# EAGLE design coreOne (EAGLE 4.16)
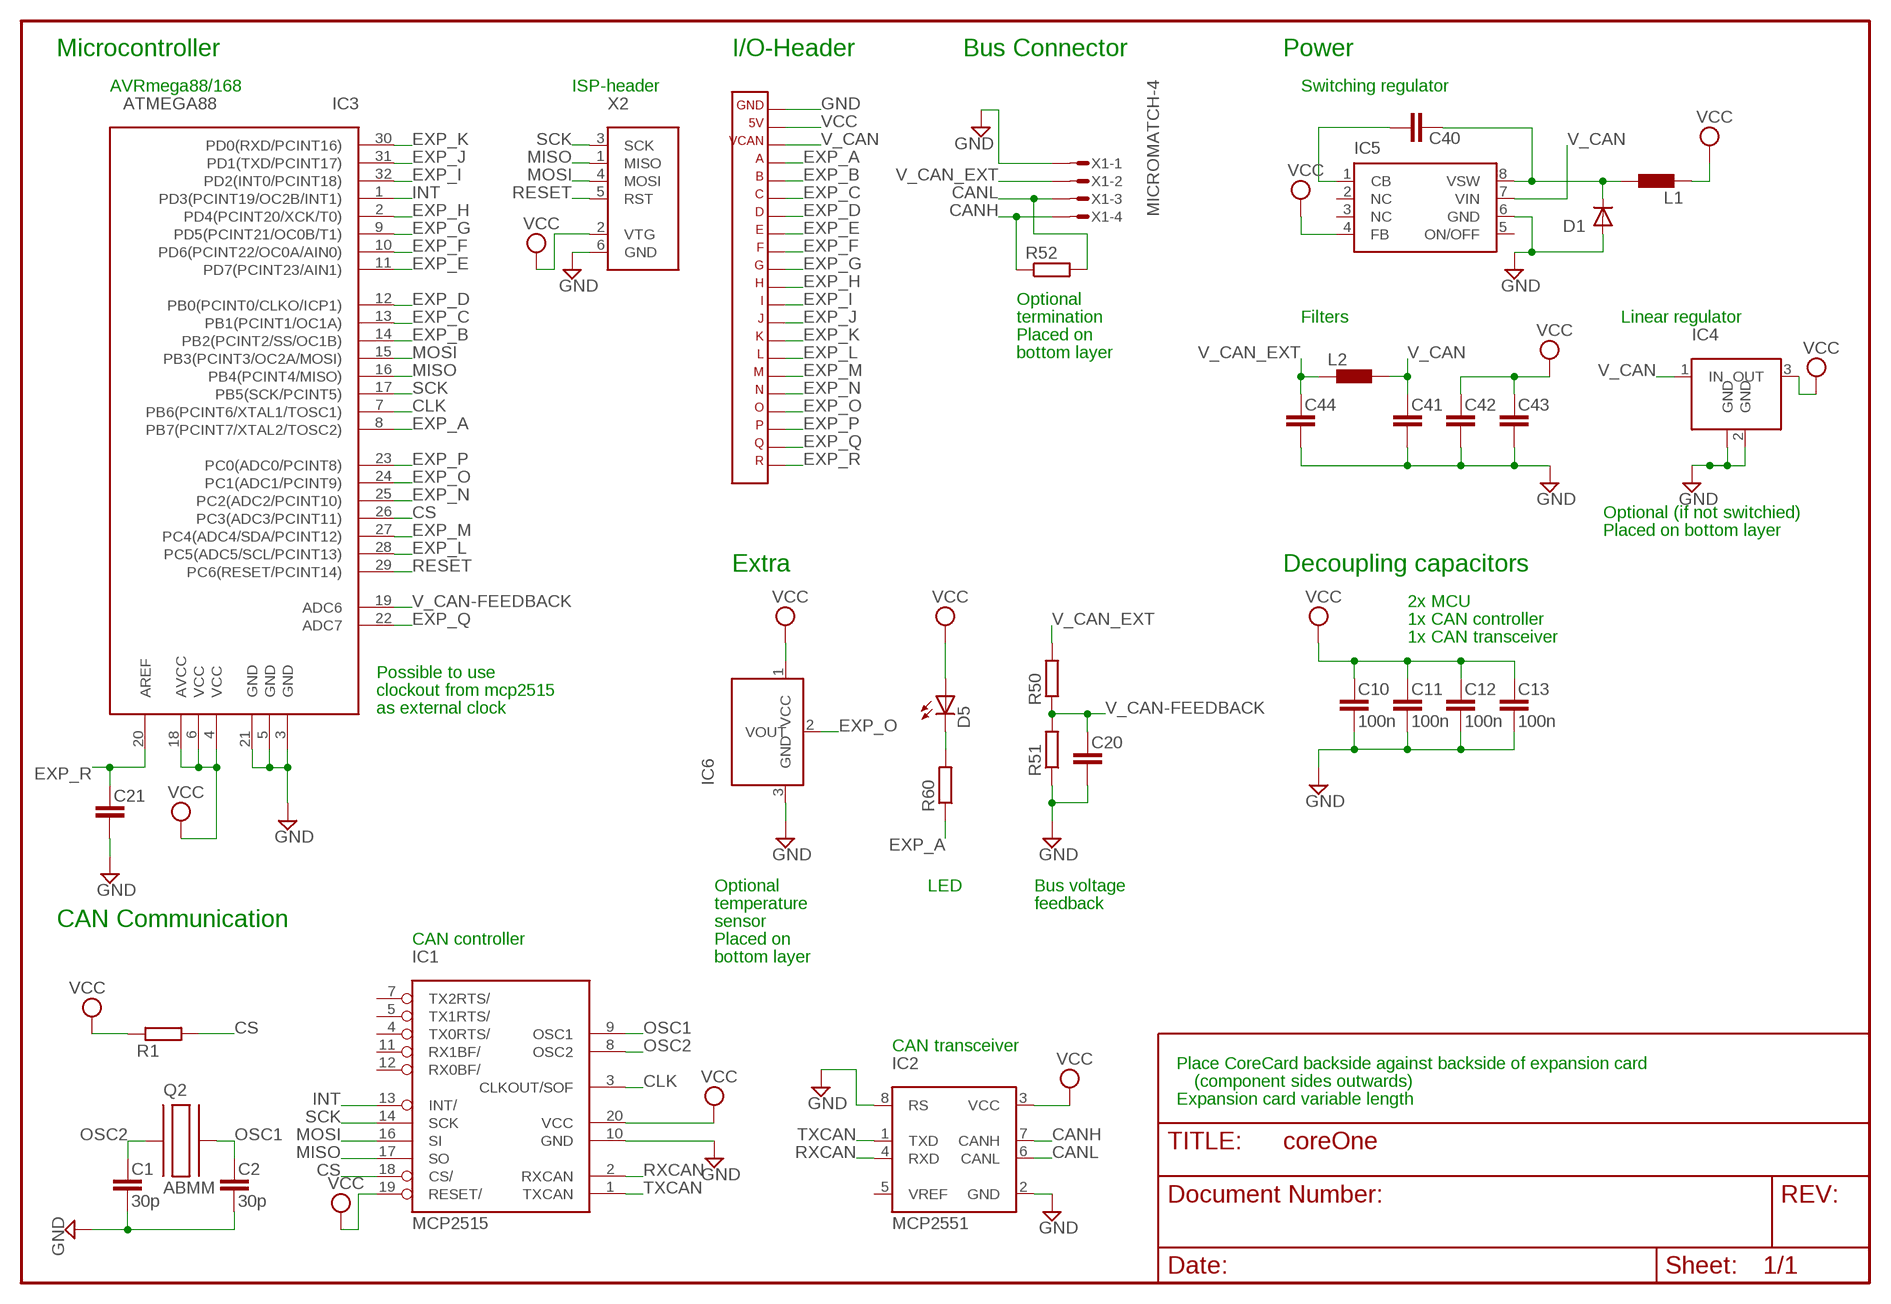
[diagram p0: schematic, sheet 1]

## Parts
C1  30p  C-EUC0603  [C0603]
C2  30p  C-EUC0603  [C0603]
C10  100n  C-EUC0603  [C0603]
C11  100n  C-EUC0603  [C0603]
C12  100n  C-EUC0603  [C0603]
C13  100n  C-EUC0603  [C0603]
C20  C-EUC0603  [C0603]
C21  C-EUC0603  [C0603]
C40  C-EUC0603  [C0603]
C41  C-EUC1210  [C1210]
C42  C-EUC1210  [C1210]
C43  C-EUC0603  [C0603]
C44  C-EUC0603  [C0603]
D1  DIODESMP  [DO-220AA]
D5  LED  [0603]
IC1  MCP2515  [TSSOP]
IC2  MCP2551  [SOIC]
IC3  ATMEGA88  [TQFP32]
IC4  LM340MP-5.0  [SOT223]
IC5  LM2674  [SO8]
IC6  TC1047A  [SOT23]
L1  L-EUL1812  [L1812]
L2  L-EUL0603  [L0603]
Q2  ABMM  [SMD]
R1  R-EUR0603  [R0603]
R50  R-EUR0603  [R0603]
R51  R-EUR0603  [R0603]
R52  R-EUR0603  [R0603]
R60  R-EUR0603  [R0603]
X1  MICROMATCH-4  [MICROMATCH-4]
X2  AVRISP6PINHEADER  [6PINHEADER]
X3  CORE_IOHEAD  [CORE_IOHEAD]

## Nets
CANH: IC2.7(CANH) R52.1 X1.4
CANL: IC2.6(CANL) R52.2 X1.3
CB: C40.1 IC5.1(CB)
CLK: IC1.3(CLKOUT/SOF) IC3.7(PB6(PCINT6/XTAL1/TOSC1))
CS: IC1.18(CS/) IC3.26(PC3(ADC3/PCINT11)) R1.2
EXP_A: IC3.8(PB7(PCINT7/XTAL2/TOSC2)) R60.1 X3.4
EXP_B: IC3.14(PB2(PCINT2/SS/OC1B)) X3.5
EXP_C: IC3.13(PB1(PCINT1/OC1A)) X3.6
EXP_D: IC3.12(PB0(PCINT0/CLKO/ICP1)) X3.7
EXP_E: IC3.11(PD7(PCINT23/AIN1)) X3.8
EXP_F: IC3.10(PD6(PCINT22/OC0A/AIN0)) X3.9
EXP_G: IC3.9(PD5(PCINT21/OC0B/T1)) X3.10
EXP_H: IC3.2(PD4(PCINT20/XCK/T0)) X3.11
EXP_I: IC3.32(PD2(INT0/PCINT18)) X3.12
EXP_J: IC3.31(PD1(TXD/PCINT17)) X3.13
EXP_K: IC3.30(PD0(RXD/PCINT16)) X3.14
EXP_L: IC3.28(PC5(ADC5/SCL/PCINT13)) X3.15
EXP_M: IC3.27(PC4(ADC4/SDA/PCINT12)) X3.16
EXP_N: IC3.25(PC2(ADC2/PCINT10)) X3.17
EXP_O: IC3.24(PC1(ADC1/PCINT9)) IC6.2(VOUT) X3.18
EXP_P: IC3.23(PC0(ADC0/PCINT8)) X3.19
EXP_Q: IC3.22(ADC7) X3.20
EXP_R: C21.1 IC3.20(AREF) X3.21
GND: C1.2 C2.2 C10.2 C11.2 C12.2 C13.2 C20.2 C21.2 C41.2 C42.2 C43.2 C44.2 D1.A IC1.10(GND) IC2.2(GND) IC2.8(RS) IC3.3(GND) IC3.5(GND) IC3.21(GND) IC4.2(GND) IC4.4(GND) IC5.6(GND) IC6.3(GND) R51.1 X1.1 X2.6(GND) X3.1
INT: IC1.13(INT/) IC3.1(PD3(PCINT19/OC2B/INT1))
MISO: IC1.17(SO) IC3.16(PB4(PCINT4/MISO)) X2.1(MISO)
MOSI: IC1.16(SI) IC3.15(PB3(PCINT3/OC2A/MOSI)) X2.4(MOSI)
N$2: D5.C R60.2
OSC1: C2.1 IC1.9(OSC1) Q2.2
OSC2: C1.1 IC1.8(OSC2) Q2.1
RESET: IC3.29(PC6(RESET/PCINT14)) X2.5(RST)
RXCAN: IC1.2(RXCAN) IC2.4(RXD)
SCK: IC1.14(SCK) IC3.17(PB5(SCK/PCINT5)) X2.3(SCK)
TXCAN: IC1.1(TXCAN) IC2.1(TXD)
V_CAN: C41.1 IC4.1(IN) IC5.7(VIN) L2.2 X3.3
V_CAN-FEEDBACK: C20.1 IC3.19(ADC6) R50.1 R51.2
V_CAN_EXT: C44.1 L2.1 R50.2 X1.2
VCC: C10.1 C11.1 C12.1 C13.1 C42.1 C43.1 D5.A IC1.19(RESET/) IC1.20(VCC) IC2.3(VCC) IC3.4(VCC) IC3.6(VCC) IC3.18(AVCC) IC4.3(OUT) IC5.4(FB) IC6.1(VCC) L1.1 R1.1 X2.2(VTG) X3.2
VSW: C40.2 D1.C IC5.8(VSW) L1.2
Unconnected: IC1.4(TX0RTS/) IC1.5(TX1RTS/) IC1.7(TX2RTS/) IC1.11(RX1BF/) IC1.12(RX0BF/) IC2.5(VREF) IC5.2(NC) IC5.3(NC) IC5.5(ON/OFF)

## Notes on the sheet
- Microcontroller | I/O-Header | Bus Connector | Power
- AVRmega88/168 | ISP-header | Switching regulator
- Optional
- termination | Filters | Linear regulator
- Placed on
- bottom layer
- Optional (if not switchied)
- Placed on bottom layer
- Extra | Decoupling capacitors
- 2x MCU
- 1x CAN controller
- 1x CAN transceiver
- Possible to use
- clockout from mcp2515
- as external clock
- Optional | LED | Bus voltage
- temperature | feedback
- CAN Communication | sensor
- CAN controller | Placed on
- bottom layer
- CAN transceiver
- Place CoreCard backside against backside of expansion card
- (component sides outwards)
- Expansion card variable length

## Power pins joined to a net without a drawn wire
GND: Q2.GND@0(GND) Q2.GND@1(GND)

## Library data of the parts
C1 C2 C10-C13 C20 C21 C40-C44 = rcl:C-EU
D1 = diode:DIODE: DIODE ultra fast rectifier, 3 A
D5 = led:LED
IC1 = mcp2515:MCP2515
IC2 = mcp2551:MCP2551
IC3 = atmega88:ATMEGA88
IC4 = lm340mp:LM340MP-5.0
IC5 = lm2674:LM2674
IC6 = tc1047a:TC1047A
L1 L2 = rcl:L-EU
Q2 = abmm:ABMM
R1 R50-R52 R60 = rcl:R-EU
X1 = con-amp-micromatch:MICROMATCH-4: MicroMaTch 4 7-215464-4 / 0-215464-4 Drawing Number C-215464 DDEController.pdf
X2 = avrisp:AVRISP6PIN
X3 = expboard:CORE_IOHEAD: CoreCard IO-header for expansion cards

## Board
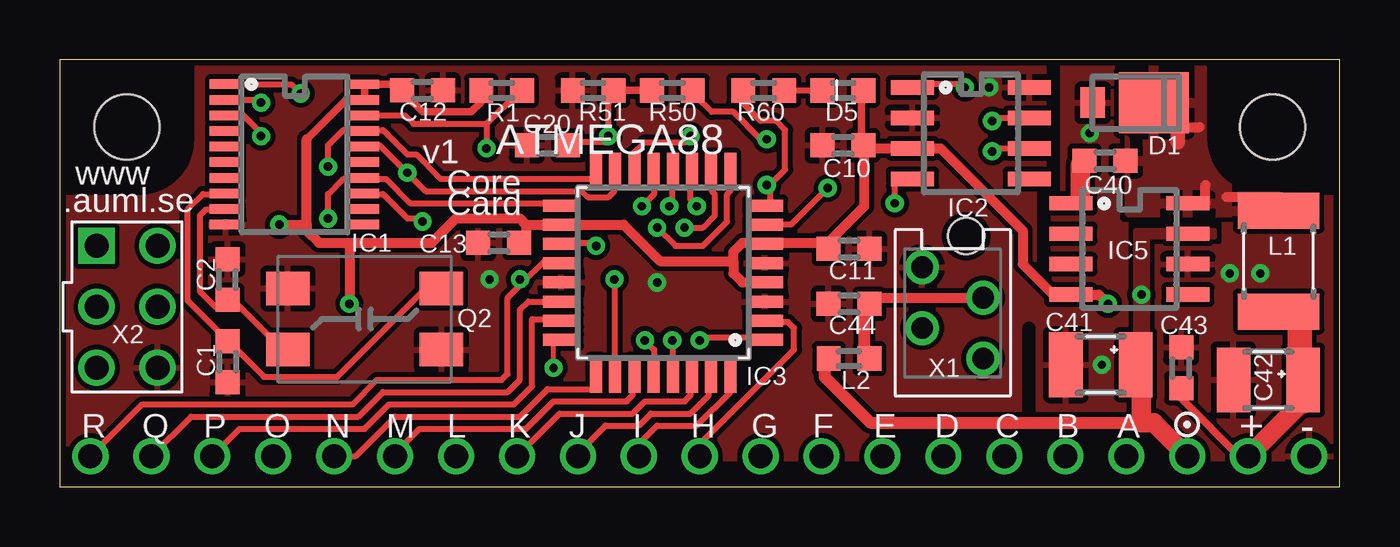
[diagram p1: board, top side]
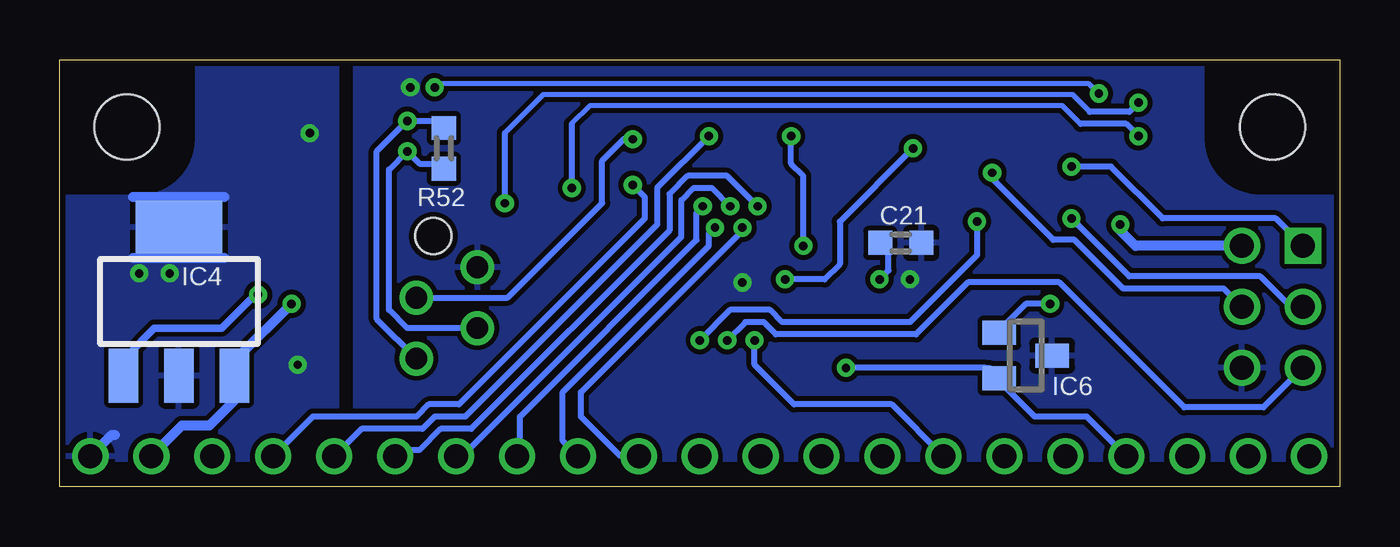
[diagram p2: board, bottom side, seen from below]

Size 53.34 x 17.78 mm. Coordinates in mm from the lower left corner, seen from the top.
Outline: 0,0 53.34,0 53.34,17.78 0,17.78 0,0
Copper layers (1*16): Top 0.035mm / dielectric 1.5mm / Bottom 0.035mm
Design rules "10mils, 0.6drill": minimum track width 8mil, minimum drill 0.35mm, track to track 8mil, track to pad 8mil, pad to pad 8mil, via to via 8mil, smd to smd 8mil, copper to edge 10mil, drill to drill 10mil, minimum pad ring 10mil, minimum via ring 8mil, stop-mask expansion 0mil, vias tented up to drill 16mil, thermal gap 10mil
Holes 2.7 mm at 50.55,14.99 2.79,14.99
tRestrict: 4 lines
bRestrict: 1 lines

### Footprints (pad centres in the part's own frame; a part is rotated, then mirrored left to right if it is on the bottom)
C0603 = smd 1 x 1: 1 -0.85,0; 2 0.85,0
C1210 = smd 1.4 x 2.7: 1 -1.4,0; 2 1.5,0
DO-220AA = smd 1.016 x 1.27: A 1.143,0 | smd 2.921 x 2.54: C -1.397,0
0603 = smd 0.991 x 1.016: A -0.85,0; C 0.85,0
TSSOP = smd 0.396 x 1.3: 1 -2.925,-2.875; 2 -2.275,-2.875; 3 -1.625,-2.875; 4 -0.975,-2.875; 5 -0.325,-2.875; 6 0.325,-2.875; 7 0.975,-2.875; 8 1.625,-2.875; 9 2.275,-2.875; 10 2.925,-2.875; 11 2.925,2.875; 12 2.275,2.875; 13 1.625,2.875; 14 0.975,2.875; 15 0.325,2.875; 16 -0.325,2.875; 17 -0.975,2.875; 18 -1.625,2.875; 19 -2.275,2.875 | smd 0.369 x 1.3: 20 -2.925,2.875
SOIC = smd 0.6 x 1.8: 1 -1.905,-2.44; 2 -0.635,-2.44; 3 0.635,-2.44; 4 1.905,-2.44; 5 1.905,2.44; 6 0.635,2.44; 7 -0.635,2.44; 8 -1.905,2.44
TQFP32 = smd 1.5 x 0.5: 1 -4.25,2.65; 2 -4.25,1.85; 3 -4.25,1.05; 4 -4.25,0.25; 5 -4.25,-0.55; 6 -4.25,-1.35; 7 -4.25,-2.15; 8 -4.25,-2.95; 17 4.25,-2.95; 18 4.25,-2.15; 19 4.25,-1.35; 20 4.25,-0.55; 21 4.25,0.25; 22 4.25,1.05; 23 4.25,1.85; 24 4.25,2.65 | smd 0.5 x 1.5: 9 -2.8,-4.4; 10 -2,-4.4; 11 -1.2,-4.4; 12 -0.4,-4.4; 13 0.4,-4.4; 14 1.2,-4.4; 15 2,-4.4; 16 2.8,-4.4; 25 2.8,4.1; 26 2,4.1; 27 1.2,4.1; 28 0.4,4.1; 29 -0.4,4.1; 30 -1.2,4.1; 31 -2,4.1; 32 -2.8,4.1
SOT223 = smd 1.219 x 2.235: 1 -2.311,-3.099; 2 0,-3.099; 3 2.311,-3.099 | smd 3.6 x 2.2: 4 0,3.099
SO8 = smd 0.6 x 1.8: 1 -1.905,-2.44; 2 -0.635,-2.44; 3 0.635,-2.44; 4 1.905,-2.44; 5 1.905,2.44; 6 0.635,2.44; 7 -0.635,2.44; 8 -1.905,2.44
SOT23 = smd 1 x 1.4: 1 -0.95,-1.1; 2 0.95,-1.1; 3 0,1.1
L1812 = smd 1.5 x 3.4: 1 -2.1,0; 2 2.1,0
L0603 = smd 0.991 x 1.016: 1 -0.85,0; 2 0.85,0
SMD = smd 1.8 x 1.4: 1 -3.2,-1.4; 2 3.2,1.15; GND@0 -3.2,1.15; GND@1 3.2,-1.4
R0603 = smd 0.991 x 1.016: 1 -0.85,0; 2 0.85,0
MICROMATCH-4 = drill 0.9 round: 1 1.905,1.27; 2 0.635,-1.27; 3 -0.635,1.27; 4 -1.905,-1.27 | hole 1.5: 3.199,-0.562
6PINHEADER = drill 1 square: 1 -1.27,2.54 | drill 1 round: 2 1.27,2.54; 3 -1.27,0; 4 1.27,0; 5 -1.27,-2.54; 6 1.27,-2.54
CORE_IOHEAD = drill 1 round: 1 25.4,0; 2 22.86,0; 3 20.32,0; 4 17.78,0; 5 15.24,0; 6 12.7,0; 7 10.16,0; 8 7.62,0; 9 5.08,0; 10 2.54,0; 11 0,0; 12 -2.54,0; 13 -5.08,0; 14 -7.62,0; 15 -10.16,0; 16 -12.7,0; 17 -15.24,0; 18 -17.78,0; 19 -20.32,0; 20 -22.86,0; 21 -25.4,0

### Placement (x,y rotation side)
C1  6.98,5.21 270 top
C2  6.98,8.64 90 top
C10  32.64,14.22 180 top
C11  32.89,9.91 0 top
C12  15.11,16.51 0 top
C13  18.29,10.16 180 top
C20  20.32,14.22 180 top
C21  18.29,10.16 0 bottom
C40  43.56,13.59 0 top
C41  43.43,5.08 180 top
C42  50.42,4.45 180 top
C43  46.74,4.95 90 top
C44  32.89,7.62 180 top
D1  44.2,16 180 top
D5  32.64,16.51 180 top
IC1  9.78,13.84 270 top
IC2  37.97,14.73 270 top
IC3  25.15,8.76 180 top
IC4  48.38,7.72 0 bottom
IC5  44.58,9.91 270 top
IC6  13.08,5.46 270 bottom
L1  50.8,9.4 90 top
L2  32.89,5.33 180 top
Q2  12.7,6.86 180 top
R1  18.41,16.51 0 top
R50  25.53,16.51 0 top
R51  22.23,16.51 0 top
R52  37.34,14.1 270 bottom
R60  29.34,16.51 0 top
X1  37.21,7.24 90 top
X2  2.79,7.49 0 top
X3  26.67,1.27 0 top

### Tracks (layer width: path | path; a pad name or v marks a point on that pad's centre or on a via)
CANH  (via drill 0.35)
  Top 0.254: v38.86,15.24 38.99,15.37 IC2.7
  Bottom 0.254: X1.4 40.13,6.98 40.13,13.97 v38.86,15.24 37.34,15.24 R52.1
CANL  (via drill 0.35)
  Top 0.254: v38.86,13.97 38.99,14.1 IC2.6
  Bottom 0.254: X1.3 38.86,6.6 39.62,7.37 39.62,13.21 v38.86,13.97 38.35,13.46 37.34,13.46 R52.2
CB
  Top 0.406: IC5.1 42.55,11.91
  Top 0.813: C40.1 42.55,13.42 42.55,11.91
CLK  (via drill 0.35)
  Top 0.254: IC1.3 6.93,15.49 7.62,15.49 8.38,14.73 v8.38,14.61 | v32,12.45 30.48,10.92 29.59,10.92 | 29.58,10.91 IC3.7
  Top 0.305: 29.59,10.92 29.58,10.91
  Bottom 0.203: 10.79,15.11 11.56,15.88 31.24,15.88 32,15.11
  Bottom 0.254: v8.38,14.61 8.89,15.11 10.79,15.11 | 32,15.11 v32,12.45
CS  (via drill 0.35)
  Top 0.254: IC1.18 14.37,15.47 14.73,15.11 17.78,15.11 | R1.2 19.27,16.3 19.05,16.38 17.78,15.11 | 17.78,15.11 v17.78,14.1 | IC3.26 23.11,4.7 v23.11,8.64
  Bottom 0.254: v17.78,14.1 20.83,11.05 20.83,9.27 21.46,8.64 v23.11,8.64
EXP_A  (via drill 0.35)
  Top 0.254: R60.1 28.45,16.42 28.58,16.26 28.32,16.13 29.21,15.24 29.84,15.24 30.23,14.86 30.23,13.21 29.59,12.57 | 29.56,11.71 IC3.8 | 29.59,12.57 29.59,11.68 | v29.46,12.57 29.59,12.57
  Top 0.305: 29.59,11.68 29.56,11.71
  Bottom 0.254: X3.4 42.8,2.92 38.48,2.92 37.97,3.43 36.7,3.43 28.96,11.18 28.96,12.07 v29.46,12.57
EXP_B  (via drill 0.35)
  Top 0.254: IC3.14 23.95,13.27 23.88,13.34 23.88,13.84 24.38,14.35 26.03,14.35 v26.29,14.61
  Bottom 0.254: v26.29,14.61 28.45,12.45 28.45,10.92 36.45,2.92 37.72,2.92 38.23,2.41 40.77,2.41 X3.5
EXP_C  (via drill 0.35)
  Top 0.254: IC3.13 24.75,13.1 24.77,13.08 24.77,12.19 v24.26,11.68
  Bottom 0.254: v24.26,11.68 25.53,12.95 27.18,12.95 27.94,12.19 27.94,10.67 36.2,2.41 37.47,2.41 38.35,1.52 39.12,1.52 X3.6
EXP_D  (via drill 0.35)
  Top 0.254: IC3.12 25.55,13.19 25.53,13.21 25.53,11.81 v25.4,11.68
  Bottom 0.254: v25.4,11.68 26.16,12.45 26.92,12.45 27.43,11.94 27.43,10.41 36.58,1.27 X3.7
EXP_E  (via drill 0.35)
  Top 0.254: IC3.11 26.35,13.14 26.29,13.08 26.29,11.94 v26.54,11.68
  Bottom 0.254: v26.54,11.68 26.8,11.43 26.8,10.29 34.16,2.92 34.16,1.27 X3.8
EXP_F  (via drill 0.35)
  Top 0.254: IC3.10 27.15,13.18 27.18,13.21 27.18,12.32 27.3,12.19 27.3,11.3 26.8,10.8 v26.03,10.8
  Bottom 0.254: X3.9 32.39,1.91 32.39,3.94 26.29,10.03 26.29,10.54 v26.03,10.8
EXP_G  (via drill 0.35)
  Top 0.254: IC3.9 27.95,13.09 27.94,13.08 27.94,12.32 27.81,12.19 27.81,11.05 26.8,10.03 25.65,10.03 v24.89,10.8
  Bottom 0.254: X3.10 29.97,1.27 31.62,2.92 31.62,3.94 24.89,10.67 v24.89,10.8
EXP_H
  Top 0.254: IC3.2 29.54,6.91 29.59,6.86 30.35,6.86 30.61,6.6 30.61,5.72 26.67,1.78 X3.11
EXP_I
  Top 0.254: IC3.32 27.95,3.94 26.54,2.54 24.89,2.54 24.13,1.78 X3.12
EXP_J
  Top 0.254: IC3.31 27.05,4.57 27.05,3.81 26.29,3.05 24.64,3.05 24.13,2.54 22.73,2.54 21.59,1.4 X3.13
EXP_K
  Top 0.254: IC3.30 26.35,4.63 26.29,4.57 26.29,3.81 26.03,3.56 24.38,3.56 23.88,3.05 20.83,3.05 X3.14
EXP_L  (via drill 0.35)
  Top 0.254: IC3.28 24.75,4.81 24.77,4.83 24.77,5.72 v24.38,6.1
  Bottom 0.254: v24.38,6.1 24.38,5.08 22.73,3.43 18.67,3.43 X3.15
EXP_M
  Top 0.254: IC3.27 23.88,4.59 23.88,3.81 23.62,3.56 20.57,3.56 19.43,2.41 14.99,2.41 13.97,1.4 X3.16
EXP_N
  Top 0.254: IC3.25 22.35,4.44 22.35,4.06 20.32,4.06 19.18,2.92 13.97,2.92 12.32,1.27 X3.17
EXP_O  (via drill 0.35)
  Top 0.203: IC3.24 20.94,6.11 20.57,5.97 v20.57,4.95
  Top 0.254: IC3.24 21.15,6.04
  Bottom 0.254: 14.73,4.95 v20.57,4.95 | 14.73,4.95 12.7,2.92 10.54,2.92 X3.18 | IC6.2 14.22,4.55 14.22,4.57 14.6,4.95 14.73,4.95
EXP_P
  Top 0.254: X3.19 7.49,2.41 12.7,2.41 13.72,3.43 18.92,3.43 19.69,4.19 19.69,6.98 20.7,6.98 20.83,6.86 20.88,6.91 IC3.23
EXP_Q
  Top 0.254: IC3.22 19.52,7.71 19.18,7.37 19.18,4.45 18.67,3.94 13.46,3.94 12.45,2.92 5.46,2.92 X3.20
EXP_R  (via drill 0.35)
  Top 0.203: IC3.20 20.87,9.31 20.83,9.4
  Top 0.254: 20.83,9.4 20.19,9.4 19.3,8.51 | 19.3,8.51 18.67,7.87 18.67,4.7 18.41,4.45 13.21,4.45 12.19,3.43 3.43,3.43 X3.21 | 19.3,8.51 v19.18,8.64
  Bottom 0.254: C21.1 18.76,10.12 18.8,10.16 18.8,9.02 v19.18,8.64
GND  (via drill 0.35)
  Bottom 0.254: 46.48,12.07 48.39,12.07 48.39,10.8
  Bottom 0.406: 46.48,12.07 50.29,12.07 | 48.39,9.52 50.29,9.52 | IC4.4 48.39,10.8 48.39,9.52 | 46.48,9.52 48.39,9.52 | X3.1 51.18,2.16 51.05,2.16
  other vias: 17.91,8.64 24.89,8.51 43.43,5.08 42.93,14.73 48.77,8.89 50.04,8.89 38.73,16.64
  pour Bottom (isolate 0.203, rank 3): 5.71,17.78 47.62,17.78 47.62,14.48 arc90 50.04,12.07 53.34,12.07 53.34,1.14 0,1.14 0,12.07 3.3,12.07 arc90 5.71,14.48
  pour Top (isolate 0.203, rank 3): 5.71,17.78 47.62,17.78 47.62,14.48 arc90 50.04,12.07 53.34,12.07 53.34,1.14 0,1.14 0,12.07 3.3,12.07 arc90 5.71,14.48
INT  (via drill 0.35)
  Top 0.254: IC1.13 12.68,12.19 13.46,12.19 14.48,11.18 14.99,11.18 v15.11,11.05 | IC3.1 29.4,6.16 29.34,6.22 26.8,6.22 v26.67,6.1
  Bottom 0.254: v15.11,11.05 15.11,9.65 17.91,6.86 23.24,6.86 23.75,7.37 25.4,7.37 v26.67,6.1
MISO  (via drill 0.35)
  Top 0.254: v11.18,13.34 11.3,13.34 11.18,13.21 11.18,14.22 11.81,14.86 12.45,14.86 12.49,14.82 IC1.17 12.69,14.86 13.46,14.86 14.48,13.84 14.86,13.84 15.87,12.83 22.26,12.83 IC3.16
  Bottom 0.254: X2.1 2.67,11.18 7.37,11.18 9.53,13.34 v11.18,13.34
MOSI  (via drill 0.35)
  Top 0.203: 21.74,12.32 22,12.07
  Top 0.254: IC1.16 12.71,14.22 13.33,14.22 v14.48,13.08 15.24,12.32 21.74,12.32 | 22,12.07 22.86,12.07 23.11,12.32 23.11,13.08 23.15,13.11 IC3.15
  Bottom 0.254: X2.4 4.83,8.26 9.02,8.26 11.05,10.29 11.94,10.29 14.6,12.95 v14.48,13.08
N$2
  Top 0.254: R60.2 30.19,16.42 30.23,16.51 D5.C 31.37,16.38
OSC1
  Top 0.254: Q2.2 9.15,5.96 8.89,6.1 7.24,7.75 6.98,7.87 C2.1 6.48,7.49 5.84,8.13 5.84,11.3 6.1,11.56 6.89,11.56 IC1.9
OSC2
  Top 0.254: Q2.1 15.24,8.26 11.56,4.57 8.51,4.57 7.28,5.8 C1.1 | C1.1 6.86,6.1 | IC1.8 6.87,12.19 5.97,12.19 5.33,11.56 5.33,7.75 6.77,6.31 C1.1
RESET  (via drill 0.35)
  Top 0.254: IC3.29 25.53,4.68 v25.53,6.1
  Bottom 0.254: X2.5 3.18,3.3 6.48,3.3 11.68,8.51 15.49,8.51 17.65,6.35 23.49,6.35 24,6.86 24.77,6.86 v25.53,6.1
RXCAN  (via drill 0.35)
  Top 0.254: IC1.2 6.98,16.12 6.98,16.13 8.26,16.13 v8.38,16 | v34.8,11.81 34.8,12.95 IC2.4
  Bottom 0.203: 10.41,15.62 11.12,16.33 33.2,16.33 34.8,14.73
  Bottom 0.254: v8.38,16 8.76,15.62 10.41,15.62 | 34.8,14.73 v34.8,11.81
SCK  (via drill 0.35)
  Top 0.254: v11.18,11.18 11.18,12.19 11.81,12.83 12.61,12.83 IC1.14 12.7,12.83 13.59,12.83 14.6,11.81 20.57,11.81 20.7,11.68 20.87,11.68 IC3.17
  Bottom 0.254: X2.3 2.03,7.49 3.3,8.76 8.76,8.76 v11.18,11.18
TXCAN  (via drill 0.35)
  Top 0.254: IC1.1 6.98,16.77 6.98,16.76 9.65,16.76 v10.03,16.38 | v37.72,16.64 37.59,16.76 35.69,16.76 35.56,16.79 IC2.1
  Bottom 0.203: v10.03,16.38 10.44,16.79 37.57,16.79
  Bottom 0.254: 37.57,16.79 v37.72,16.64
V_CAN  (via drill 0.35)
  Top 0.406: L2.2 31.88,5.25
  Top 0.508: 45.09,2.67 33.78,2.67 31.88,4.57 31.88,5.25
  Top 0.813: C41.1 45.09,5.08 45.09,2.67 45.59,2.67 X3.3
  Bottom 0.254: v45.09,8 45.21,8
  Bottom 0.305: IC4.1 50.67,4.52 50.67,4.57 50.36,4.89 | 50.36,4.89 50.29,4.95 | 45.21,8 46.61,6.6 49.4,6.6 50.55,5.46 50.55,5.08 50.36,4.89
  pour Top (isolate 0.203, no thermals): 44.83,10.67 44.83,3.3 45.34,3.3 45.34,10.41 48.13,10.41 48.13,10.67
V_CAN-FEEDBACK  (via drill 0.35)
  Top 0.254: R51.2 22.99,16.42 22.99,16.13 22.86,16 v22.86,14.61 22.86,14.48 22.73,14.35 21.34,14.35 21.3,14.31 C20.1 | IC3.19 20.94,10.16 22.23,10.16 v22.35,10.03
  Top 0.305: R51.2 R50.1
  Bottom 0.254: v22.86,14.61 22.86,13.46 22.35,12.95 v22.35,10.03
V_CAN_EXT  (via drill 0.35)
  Top 0.254: v29.46,14.48 29.21,14.48 28.07,15.62 27.18,15.62 26.54,16.26 26.42,16.47 R50.2
  Top 0.406: 33.53,7.62 C44.1 33.74,7.87 X1.2 | L2.1 33.53,5.37
  Top 0.508: 33.53,5.37 33.53,7.62
  Bottom 0.254: v29.46,14.48 29.84,14.48 30.73,13.59 30.73,11.81 34.67,7.87 X1.2
VCC  (via drill 0.35)
  Top 0.254: IC1.19 12.7,16.17 | 12.7,16.76 IC1.20 | 14.22,16.76 14.22,16.68 C12.1 14.52,16.3 14.48,16.26 | R1.1 17.56,16.42 17.53,16.38 | 20.95,10.92 20.95,10.91 IC3.18 20.76,10.92 | 28.96,10.03 29.08,10.16 29.13,10.11 IC3.6 29.29,10.11 29.21,10.03 | 29.21,8.51 | 19.05,10.16 18.92,10.16 | 33.53,14.22 C10.1 33.4,14.35 | IC2.3 35.66,14.1 | IC3.4
  Top 0.305: 10.29,14.48 11.94,16.13 IC1.19 | 12.7,16.17 12.7,16.76 | IC1.20 14.22,16.76 | 17.53,16.38 17.53,16 17.15,15.62 15.11,15.62 14.48,16.26 | 33.66,14.1 33.4,14.35 33.4,16.51 D5.A | 29.34,10.16 29.34,10.05 IC3.6 29.44,10.16 | 41.4,8 IC5.4 | C11.1 32.13,10.29 32.13,9.78 31.75,10.16 | 33.53,14.35 C10.1 | C13.1 19.05,10.16 19.43,10.67 | X3.2 49.53,1.14 49.28,1.14 46.74,3.68 C43.1 | IC3.4 29.21,8.51
  Top 0.406: 12.06,10.16 10.79,10.16 10.29,10.67 10.29,10.92 | 12.06,10.16 15.49,10.16 16.51,11.18 19.18,11.18 19.43,10.92 | 41.4,8 40.13,9.27 40.13,10.67 36.7,14.1 35.66,14.1 | 20.95,10.92 23.49,10.92 25.02,9.4 28.07,9.4 | 29.21,8.51 28.45,8.51 28.07,8.89 28.07,9.4 | 19.43,10.92 20.76,10.92 | 33.66,14.1 IC2.3 | 10.29,10.92 10.29,14.48 | 28.07,9.4 28.07,9.78 28.45,10.16 29.34,10.16 | IC5.4 43.31,8 v43.69,7.62 | 12.06,10.16 v12.06,7.62 | v9.14,10.92 10.29,10.92 | 32.13,10.29 33.53,11.68 33.53,14.35 | 19.43,10.92 19.43,10.67 | 29.44,10.16 31.75,10.16
  Top 0.66: X3.2 49.66,1.4
  Top 0.762: 49.66,1.4 51.82,3.56
  Top 1.016: L1.1 51.31,7.3 51.31,7.24 51.69,7.24 51.69,4.45 C42.1 51.82,3.56
  Bottom 0.254: v12.06,7.62 13.08,7.62 14.18,6.52 14.14,6.48 14.12,6.48 | 14.12,6.48 IC6.1 | 14.12,6.48 14.1,6.48
  Bottom 0.406: X2.2 8.51,10.03 9.14,10.67 v9.14,10.92 | X3.2 48.26,2.54 47.12,2.54 46.1,3.56 46.1,4.46 IC4.3 45.95,5.36 v43.69,7.62
VSW
  Top 0.406: 47.5,14.99 46.61,14.99 45.59,14.99 D1.C | 48.64,12.07 50.8,12.07 50.8,11.56 | 50.67,11.43 50.55,11.43 | 50.67,11.43 50.8,11.43 50.8,11.56 | 50.8,11.56 50.67,11.56 50.67,11.43 | 47.75,12.57 47.75,11.81 46.36,11.81
  Top 0.61: 46.61,14.99 46.61,14.35
  pour Top (isolate 0.203): 44.58,17.4 44.58,11.43 52.2,11.43 52.2,12.07 50.04,12.07 arc-90 47.62,14.48 47.62,17.4

### Text on the board
Top: Copper, top side
Bottom: Copper, bottom side
tPlace: v1 | www | Core | .auml.se | Card | Silcscreen, top side
tStop: Soldermask, top side
bStop: Soldermask, bottom side
Document: Separate power GND and signal GND